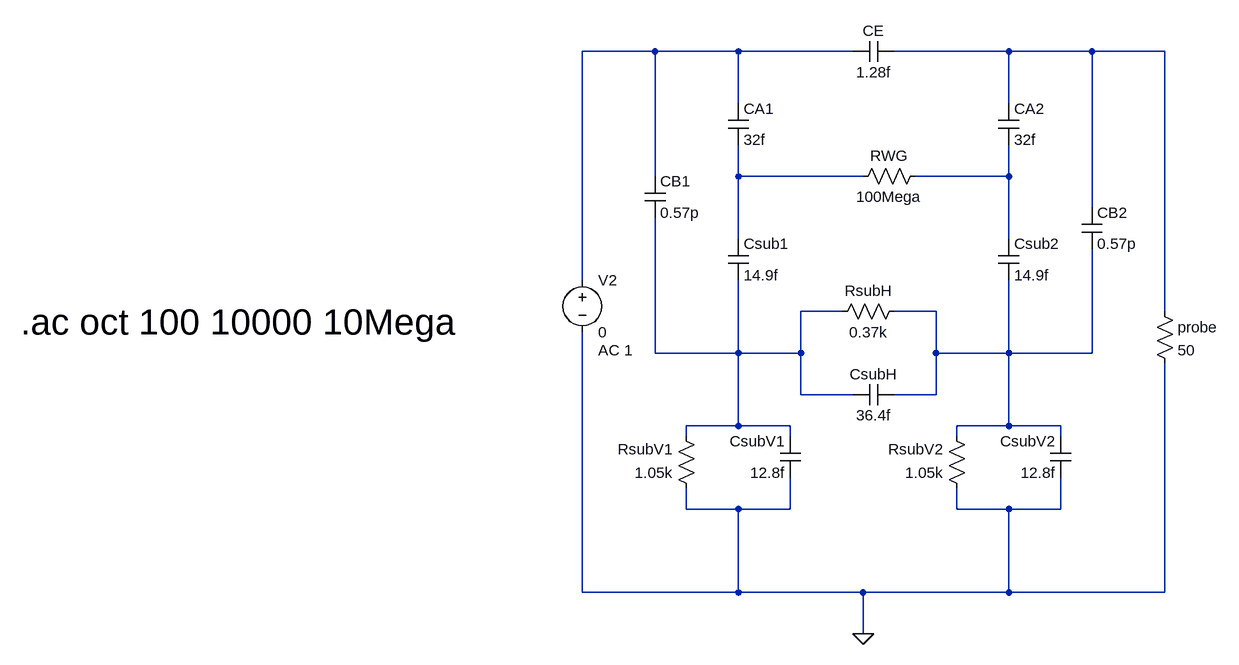
[diagram p0: schematic CLIPP_Yf_simulation.asc]
CLIPP_Yf_simulation.asc, the LTspice schematic file:
Version 4
SHEET 1 34416 9044
WIRE 15504 2192 15392 2192
WIRE 15632 2192 15504 2192
WIRE 15808 2192 15632 2192
WIRE 16048 2192 15872 2192
WIRE 16176 2192 16048 2192
WIRE 16288 2192 16176 2192
WIRE 15632 2272 15632 2192
WIRE 16048 2272 16048 2192
WIRE 15504 2384 15504 2192
WIRE 15632 2384 15632 2336
WIRE 15824 2384 15632 2384
WIRE 16048 2384 16048 2336
WIRE 16048 2384 15904 2384
WIRE 16176 2432 16176 2192
WIRE 15632 2480 15632 2384
WIRE 16048 2480 16048 2384
WIRE 15392 2544 15392 2192
WIRE 15792 2592 15728 2592
WIRE 15936 2592 15872 2592
WIRE 16288 2592 16288 2192
WIRE 15504 2656 15504 2448
WIRE 15632 2656 15632 2544
WIRE 15632 2656 15504 2656
WIRE 15728 2656 15728 2592
WIRE 15728 2656 15632 2656
WIRE 15936 2656 15936 2592
WIRE 16048 2656 16048 2544
WIRE 16048 2656 15936 2656
WIRE 16176 2656 16176 2496
WIRE 16176 2656 16048 2656
WIRE 15728 2720 15728 2656
WIRE 15808 2720 15728 2720
WIRE 15936 2720 15936 2656
WIRE 15936 2720 15872 2720
WIRE 15632 2768 15632 2656
WIRE 15632 2768 15552 2768
WIRE 15712 2768 15632 2768
WIRE 16048 2768 16048 2656
WIRE 16048 2768 15968 2768
WIRE 16128 2768 16048 2768
WIRE 15552 2784 15552 2768
WIRE 15712 2784 15712 2768
WIRE 15968 2784 15968 2768
WIRE 16128 2784 16128 2768
WIRE 15552 2896 15552 2864
WIRE 15632 2896 15552 2896
WIRE 15712 2896 15712 2848
WIRE 15712 2896 15632 2896
WIRE 15968 2896 15968 2864
WIRE 16048 2896 15968 2896
WIRE 16128 2896 16128 2848
WIRE 16128 2896 16048 2896
WIRE 15392 3024 15392 2624
WIRE 15632 3024 15632 2896
WIRE 15632 3024 15392 3024
WIRE 15824 3024 15632 3024
WIRE 16048 3024 16048 2896
WIRE 16048 3024 15824 3024
WIRE 16288 3024 16288 2672
WIRE 16288 3024 16048 3024
WIRE 15824 3088 15824 3024
FLAG 15824 3088 0
SYMBOL voltage 15392 2528 R0
WINDOW 123 24 124 Left 2
WINDOW 39 0 0 Left 2
SYMATTR Value2 AC 1
SYMATTR InstName V2
SYMATTR Value 0
SYMBOL cap 15616 2272 R0
SYMATTR InstName CA1
SYMATTR Value 32f
SYMBOL cap 16032 2272 R0
SYMATTR InstName CA2
SYMATTR Value 32f
SYMBOL res 15920 2368 R90
WINDOW 0 0 56 VBottom 2
WINDOW 3 32 56 VTop 2
SYMATTR InstName RWG
SYMATTR Value 100Mega
SYMBOL cap 15488 2384 R0
SYMATTR InstName CB1
SYMATTR Value 0.57p
SYMBOL cap 16160 2432 R0
SYMATTR InstName CB2
SYMATTR Value 0.57p
SYMBOL cap 15616 2480 R0
SYMATTR InstName Csub1
SYMATTR Value 14.9f
SYMBOL cap 16032 2480 R0
SYMATTR InstName Csub2
SYMATTR Value 14.9f
SYMBOL res 15568 2880 R180
WINDOW 0 36 76 Left 2
WINDOW 3 36 40 Left 2
SYMATTR InstName RsubV1
SYMATTR Value 1.05k
SYMBOL res 15888 2576 R90
WINDOW 0 0 56 VBottom 2
WINDOW 3 32 56 VTop 2
SYMATTR InstName RsubH
SYMATTR Value 0.37k
SYMBOL res 16272 2576 R0
SYMATTR InstName probe
SYMATTR Value 50
SYMBOL cap 15872 2704 R90
WINDOW 0 0 32 VBottom 2
WINDOW 3 32 32 VTop 2
SYMATTR InstName CsubH
SYMATTR Value 36.4f
SYMBOL cap 15728 2848 R180
WINDOW 0 24 56 Left 2
WINDOW 3 24 8 Left 2
SYMATTR InstName CsubV1
SYMATTR Value 12.8f
SYMBOL res 15984 2880 R180
WINDOW 0 36 76 Left 2
WINDOW 3 36 40 Left 2
SYMATTR InstName RsubV2
SYMATTR Value 1.05k
SYMBOL cap 16144 2848 R180
WINDOW 0 24 56 Left 2
WINDOW 3 24 8 Left 2
SYMATTR InstName CsubV2
SYMATTR Value 12.8f
SYMBOL cap 15872 2176 R90
WINDOW 0 0 32 VBottom 2
WINDOW 3 32 32 VTop 2
SYMATTR InstName CE
SYMATTR Value 1.28f
TEXT 14528 2608 Left 5 !.ac oct 100 10000 10Mega

The netlist it stands for:
* CLIPP_Yf_simulation.asc
V2 N001 0 0 AC 1
CA1 N001 N003 32f
CA2 N002 N004 32f
RWG N004 N003 100Mega
CB1 N001 N005 0.57p
CB2 N002 N006 0.57p
Csub1 N003 N005 14.9f
Csub2 N004 N006 14.9f
RsubV1 0 N005 1.05k
RsubH N006 N005 0.37k
R§probe N002 0 50
CsubH N006 N005 36.4f
CsubV1 0 N005 12.8f
RsubV2 0 N006 1.05k
CsubV2 0 N006 12.8f
CE N002 N001 1.28f
.ac oct 100 10000 10Mega
.backanno
.end